# Altium schematic sheet Optocoupler_module.SchDoc: Optocoupler module
size A3; Author: M.Beldyga; CompanyName: WUT ISE; DrawnBy: M.Beldyga; Organization: WUT ISE; Address1: PW ISE; Address2: Nowowiejska 15/19 00-665 Warsaw; Address3: micbeldyga@gmail.com; SheetNumber: 1; SheetTotal: 2; ModifiedBy: -; CheckedDate: -; Title2: 7x AFBR-FS50B00; DivGrp: WUT ISE; Designer: M.Beldyga; ModifiedDate: -; ProjectName: Sensor Box
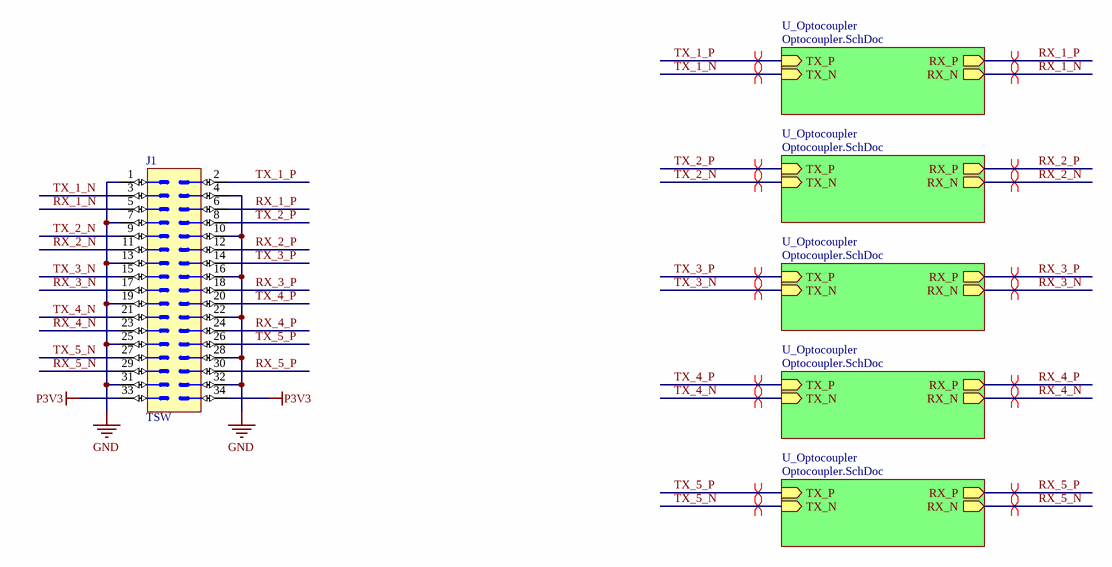
[diagram p0: Optocoupler_module.SchDoc]

## Parts
J1  TSW  [SAMTEC_SW-117-08]

## Sub-sheets
U_Optocoupler = Optocoupler.SchDoc: TX_P (in), TX_N (in), RX_P (out), RX_N (out)
U_Optocoupler = Optocoupler.SchDoc: TX_P (in), TX_N (in), RX_P (out), RX_N (out)
U_Optocoupler = Optocoupler.SchDoc: TX_P (in), TX_N (in), RX_P (out), RX_N (out)
U_Optocoupler = Optocoupler.SchDoc: TX_P (in), TX_N (in), RX_P (out), RX_N (out)
U_Optocoupler = Optocoupler.SchDoc: TX_P (in), TX_N (in), RX_P (out), RX_N (out)

## Nets
GND: J1.1 J1.4 J1.7 J1.10 J1.13 J1.16 J1.19 J1.22 J1.25 J1.28 J1.31 J1.32
P3V3: J1.33 J1.34
RX_1_N: J1.5 ; sheet U_Optocoupler/RX_N
RX_1_P: J1.6 ; sheet U_Optocoupler/RX_P
RX_2_N: J1.11 ; sheet U_Optocoupler/RX_N
RX_2_P: J1.12 ; sheet U_Optocoupler/RX_P
RX_3_N: J1.17 ; sheet U_Optocoupler/RX_N
RX_3_P: J1.18 ; sheet U_Optocoupler/RX_P
RX_4_N: J1.23 ; sheet U_Optocoupler/RX_N
RX_4_P: J1.24 ; sheet U_Optocoupler/RX_P
RX_5_N: J1.29 ; sheet U_Optocoupler/RX_N
RX_5_P: J1.30 ; sheet U_Optocoupler/RX_P
TX_1_N: J1.3 ; sheet U_Optocoupler/TX_N
TX_1_P: J1.2 ; sheet U_Optocoupler/TX_P
TX_2_N: J1.9 ; sheet U_Optocoupler/TX_N
TX_2_P: J1.8 ; sheet U_Optocoupler/TX_P
TX_3_N: J1.15 ; sheet U_Optocoupler/TX_N
TX_3_P: J1.14 ; sheet U_Optocoupler/TX_P
TX_4_N: J1.21 ; sheet U_Optocoupler/TX_N
TX_4_P: J1.20 ; sheet U_Optocoupler/TX_P
TX_5_N: J1.27 ; sheet U_Optocoupler/TX_N
TX_5_P: J1.26 ; sheet U_Optocoupler/TX_P

## Layout directives
differential pair; net class D100: RX_1_N, RX_1_P, RX_2_N, RX_2_P, RX_3_N, RX_3_P, RX_4_N, RX_4_P, RX_5_N, RX_5_P, TX_1_N, TX_1_P, TX_2_N, TX_2_P, TX_3_N, TX_3_P, TX_4_N, TX_4_P, TX_5_N, TX_5_P

## Notes on the sheet
- Project/Equipment
- Document
- Designer
- Drawn by
- Check.by
- Contact
- File
- Last Mod.
- Print Date
- Sheet
- Size
- A3
- of
- Rev

## Library data of the parts
J1 = TSW-117-08-T-D-RA: Connector 34 Male; Part Description: Classic PCB Header Strips, 0.100" pitch; Manufacturer: SAMTEC; PressFit: No; Part Number: TSW-117-08-T-D-RA; Component Kind: Standard; Component Type: Standard; Pin Count: 34; Family: TSW; SMD: No; Status: Active; Manufacturer Part Number: TSW-117-08-T-D-RA; ComponentHeight: 5.56mm; Author: Michal Beldyga; CreateDate: 2/18/2025; LatestRevisionDate: 2/18/2025